# Altium project YunKeyboard.PrjPcb
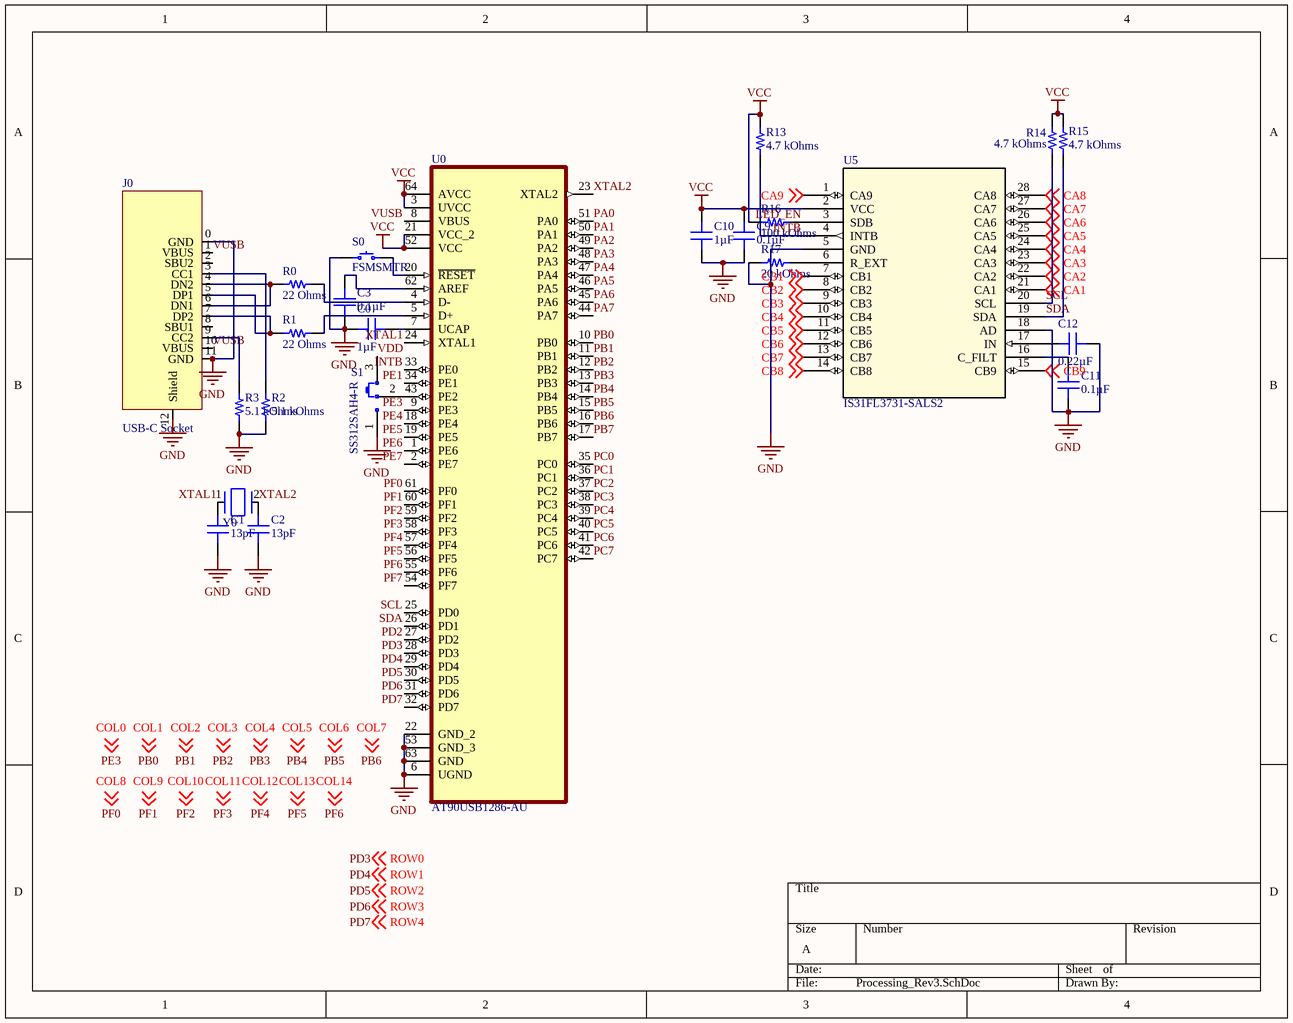
[diagram p0: Processing_Rev3.SchDoc]
3 sheets, 176 parts. Net scope: global (net labels, ports and power ports of the same name join across sheets).
Board file: YunKeyboard.PcbDoc
Sheets:
  Processing_Rev3.SchDoc
  BatUSBSwitchRev2.SchDoc
  KeyMatrixRev2.SchDoc

## Sheet Processing_Rev3.SchDoc
size A

### Parts
C0  1µF  [CAP 0805_2012]
C1  13pF  [CAP 0805_2012]
C2  13pF  [CAP 0805_2012]
C3  0.1µF  [CAP 0805_2012]
C9  0.1µF  [CAP 0805_2012]
C10  1µF  [CAP 0805_2012]
C11  0.1µF  [CAP 0805_2012]
C12  0.22µF  [CAP 0805_2012]
J0  USB-C Socket  [TYPE-C-31-M-12]
R0  22 Ohms  [RES 0805_2012]
R1  22 Ohms  [RES 0805_2012]
R2  5.1 kOhms  [RES 0805_2012]
R3  5.1 kOhms  [RES 0805_2012]
R13  4.7 kOhms  [RES 0805_2012]
R14  4.7 kOhms  [RES 0805_2012]
R15  4.7 kOhms  [RES 0805_2012]
R16  100 kOhms  [RES 0805_2012]
R17  20 kOhms  [RES 0805_2012]
S0  FSMSMTR  [TE FSMSMTR]
S1  SS312SAH4-R  [NKK SS312SAH4]
U0  AT90USB1286-AU  [QFP80P1600X1600X120-64N]
U5  IS31FL3731-SALS2  [SSOP-28_ISI]
Y0  9B-16.000MEEJ-B  [9B-16.000MEEJ-B]  (value not drawn)

### Nets
GND: C0.1 C1.1 C2.1 C3.1 C9.2 C10.2 C11.1 C12.1 J0.0(GND) J0.11(GND) J0.12(Shield) R2.1 R3.1 R17.2 S0.1 S1.1 U0.6(UGND) U0.22(GND_2) U0.53(GND_3) U0.63(GND) U5.5(GND) U5.18(AD)
VCC: C9.1 C10.1 R13.2 R14.2 R15.2 R16.1 U0.3(UVCC) U0.21(VCC_2) U0.52(VCC) U0.64(AVCC) U5.2(VCC)
CA1: U5.21(CA1) ; off-sheet CA1
CA2: U5.22(CA2) ; off-sheet CA2
CA3: U5.23(CA3) ; off-sheet CA3
CA4: U5.24(CA4) ; off-sheet CA4
CA5: U5.25(CA5) ; off-sheet CA5
CA6: U5.12(CB6) U5.26(CA6) ; off-sheet CA6, off-sheet CB6  [also labelled CB6]
CA7: U5.13(CB7) U5.27(CA7) ; off-sheet CA7, off-sheet CB7  [also labelled CB7]
CA8: U5.14(CB8) U5.28(CA8) ; off-sheet CA8, off-sheet CB8  [also labelled CB8]
CA9: U5.1(CA9) ; off-sheet CA9
CB1: U5.7(CB1) ; off-sheet CB1
CB2: U5.8(CB2) ; off-sheet CB2
CB3: U5.9(CB3) ; off-sheet CB3
CB4: U5.10(CB4) ; off-sheet CB4
CB5: U5.11(CB5) ; off-sheet CB5
CB9: U5.15(CB9) ; off-sheet CB9
INTB: R13.1 U0.33(PE0) U5.4(INTB)
LED_EN: R16.2 U5.3(SDB)
PA0: U0.51(PA0)
PA1: U0.50(PA1)
PA2: U0.49(PA2)
PA3: U0.48(PA3)
PA4: U0.47(PA4)
PA5: U0.46(PA5)
PA6: U0.45(PA6)
PA7: U0.44(PA7)
PB0: U0.10(PB0) ; off-sheet COL1  [also labelled COL1]
PB1: U0.11(PB1) ; off-sheet COL2  [also labelled COL2]
PB2: U0.12(PB2) ; off-sheet COL3  [also labelled COL3]
PB3: U0.13(PB3) ; off-sheet COL4  [also labelled COL4]
PB4: U0.14(PB4) ; off-sheet COL5  [also labelled COL5]
PB5: U0.15(PB5) ; off-sheet COL6  [also labelled COL6]
PB6: U0.16(PB6) ; off-sheet COL7  [also labelled COL7]
PB7: U0.17(PB7)
PC0: U0.35(PC0)
PC1: U0.36(PC1)
PC2: U0.37(PC2)
PC3: U0.38(PC3)
PC4: U0.39(PC4)
PC5: U0.40(PC5)
PC6: U0.41(PC6)
PC7: U0.42(PC7)
PD2: U0.27(PD2)
PD3: U0.28(PD3) ; off-sheet ROW0  [also labelled ROW0]
PD4: U0.29(PD4) ; off-sheet ROW1  [also labelled ROW1]
PD5: U0.30(PD5) ; off-sheet ROW2  [also labelled ROW2]
PD6: U0.31(PD6) ; off-sheet ROW3  [also labelled ROW3]
PD7: U0.32(PD7) ; off-sheet ROW4  [also labelled ROW4]
PE1: U0.34(PE1)
PE3: U0.9(PE3) ; off-sheet COL0  [also labelled COL0]
PE4: U0.18(PE4)
PE5: U0.19(PE5)
PE6: U0.1(PE6)
PE7: U0.2(PE7)
PF0: U0.61(PF0) ; off-sheet COL8  [also labelled COL8]
PF1: U0.60(PF1) ; off-sheet COL9  [also labelled COL9]
PF2: U0.59(PF2) ; off-sheet COL10  [also labelled COL10]
PF3: U0.58(PF3) ; off-sheet COL11  [also labelled COL11]
PF4: U0.57(PF4) ; off-sheet COL12  [also labelled COL12]
PF5: U0.56(PF5) ; off-sheet COL13  [also labelled COL13]
PF6: U0.55(PF6) ; off-sheet COL14  [also labelled COL14]
PF7: U0.54(PF7)
SCL: R14.1 U0.25(PD0) U5.20(SCL)
SDA: R15.1 U0.26(PD1) U5.19(SDA)
VDD: S1.3
VUSB: J0.1(VBUS) J0.10(VBUS) U0.8(VBUS)
XTAL1: C1.2 U0.24(XTAL1) Y0.1
XTAL2: C2.2 U0.23(XTAL2) Y0.2
NetC0_2: C0.2 U0.7(UCAP)
NetC3_2: C3.2 U0.62(AREF)
NetC11_2: C11.2 U5.16(C_FILT)
NetC12_2: C12.2 U5.17(IN)
NetJ0_3: J0.3(CC1) R2.2
NetJ0_4: J0.4(DN2) J0.6(DN1) R0.1
NetJ0_5: J0.5(DP1) J0.7(DP2) R1.1
NetJ0_9: J0.9(CC2) R3.2
NetR0_2: R0.2 U0.4(D-)
NetR1_2: R1.2 U0.5(D+)
NetR17_1: R17.1 U5.6(R_EXT)
NetS0_2: S0.2 U0.20(~{RESET})
NetS1_2: S1.2(COM) U0.43(PE2)

Not connected (* = marked no-connect by the designer): J0 2(SBU2) 8(SBU1)

### Library data of the parts
C0 C10 = GRM219R7YA105KA12D: CAP CER 1UF 35V X7R 0805; Manufacturer: Murata Electronics; Tolerance: ±10%; Part Number: GRM219R7YA105KA12D; Value: 1µF; Applications: General Purpose; Capacitance: 1µF; ComponentLink1Description: Datasheet; ComponentLink1URL: https://search.murata.co.jp/Ceramy/image/img/A01X/G101/ENG/GRM219R7YA105KA12-01.pdf; ComponentLink2Description: DigiKey Link; ComponentLink2URL: http://digikey.com/product-detail/en/murata-electronics/GRM219R7YA105KA12D/490-10494-1-ND/5026417; Device Package: 0805 (2012 Metric); LastUpdated: 1/21/2020 12:02:41 AM; Lifecycle Status: Active; Minimum Order: 1; Mounting Type: Surface Mount, MLCC; Operating Temperature: -55°C ~ 125°C; Package / Case: 0805 (2012 Metric); Packaging: TapeAndReel; PartId: 16877; Part Status: Active; Price: 0.05; Series: GRM; Size / Dimension: 0.079" L x 0.049" W (2.00mm x 1.25mm); Supplier 1: DigiKey; Supplier Part Number 1: 490-10494-1-ND; Temperature Coefficient: X7R; Thickness (Max): 0.037" (0.95mm); Voltage - Rated: 35V
C1 C2 = CBR08C130JAGAC: CAP CER 13PF 250V C0G/NP0 0805; Manufacturer: KEMET; Temperature Coefficient: C0G, NP0; Tolerance: ±5%; Part Number: CBR08C130JAGAC; Value: 13pF; Applications: RF, Microwave, High Frequency; Capacitance: 13pF; ComponentLink1Description: Datasheet; ComponentLink1URL: https://api.kemet.com/component-edge/download/datasheet/CBR08C130JAGAC.pdf; ComponentLink2Description: DigiKey Link; ComponentLink2URL: http://digikey.com/product-detail/en/kemet/CBR08C130JAGAC/399-8694-1-ND/3480285; Device Package: 0805 (2012 Metric); Features: High Q, Low Loss, Ultra Low ESR; LastUpdated: 1/21/2020 12:03:06 AM; Lifecycle Status: Active; Minimum Order: 1; Mounting Type: Surface Mount, MLCC; Operating Temperature: -55°C ~ 125°C; Package / Case: 0805 (2012 Metric); Packaging: TapeAndReel; PartId: 2446; Part Status: Active; Price: 0.50; Series: CBR-SMD RF C0G; Size / Dimension: 0.079" L x 0.049" W (2.00mm x 1.25mm); Supplier 1: DigiKey; Supplier Part Number 1: 399-8694-1-ND; Thickness (Max): 0.035" (0.88mm); Voltage - Rated: 250V
C3 C9 C11 = GRM21B7U1A104JA01L: CAP CER 0.1UF 10V U2J 0805; Manufacturer: Murata Electronics; Tolerance: ±5%; Part Number: GRM21B7U1A104JA01L; Value: 0.1µF; Applications: General Purpose; Capacitance: 0.1µF; ComponentLink1Description: Datasheet; ComponentLink1URL: https://search.murata.co.jp/Ceramy/image/img/A01X/G101/ENG/GRM21B7U1A104JA01-01.pdf; ComponentLink2Description: DigiKey Link; ComponentLink2URL: http://digikey.com/product-detail/en/murata-electronics/GRM21B7U1A104JA01L/490-11592-1-ND/5333432; Device Package: 0805 (2012 Metric); LastUpdated: 1/21/2020 12:02:41 AM; Lifecycle Status: Active; Minimum Order: 1; Mounting Type: Surface Mount, MLCC; Operating Temperature: -55°C ~ 125°C; Package / Case: 0805 (2012 Metric); Packaging: TapeAndReel; PartId: 16804; Part Status: Active; Price: 0.09; Series: GRM; Size / Dimension: 0.079" L x 0.049" W (2.00mm x 1.25mm); Supplier 1: DigiKey; Supplier Part Number 1: 490-11592-1-ND; Temperature Coefficient: U2J; Thickness (Max): 0.053" (1.35mm); Voltage - Rated: 10V
C12 = GCM21BR71H224KA37L: CAP CER 0.22UF 50V X7R 0805; Manufacturer: Murata Electronics; Tolerance: ±10%; Part Number: GCM21BR71H224KA37L; Value: 0.22µF; Applications: Automotive; Capacitance: 0.22µF; ComponentLink1Description: Datasheet; ComponentLink1URL: https://www.murata.com/~/media/webrenewal/support/library/catalog/products/capacitor/mlcc/c03e.ashx?la=en-us; ComponentLink2Description: DigiKey Link; ComponentLink2URL: http://digikey.com/product-detail/en/murata-electronics/GCM21BR71H224KA37L/490-4970-1-ND/1765289; Device Package: 0805 (2012 Metric); LastUpdated: 1/21/2020 12:03:05 AM; Lifecycle Status: Active; Minimum Order: 1; Mounting Type: Surface Mount, MLCC; Operating Temperature: -55°C ~ 125°C; Package / Case: 0805 (2012 Metric); Packaging: TapeAndReel; PartId: 2725; Part Status: Active; Price: 0.08; Ratings: AEC-Q200; Series: GCM; Size / Dimension: 0.079" L x 0.049" W (2.00mm x 1.25mm); Supplier 1: DigiKey; Supplier Part Number 1: 490-4970-1-ND; Temperature Coefficient: X7R; Thickness (Max): 0.055" (1.40mm); Voltage - Rated: 50V
J0 = TYPE-C-31-M-12
R0 R1 = ERA-6AHD220V: RES 22 OHM 0.5% 1/8W 0805; Manufacturer: Panasonic Electronic Components; Power (Watts): 0.125W, 1/8W; Temperature Coefficient: ±50ppm/°C; Part Number: ERA-6AHD220V; Value: 22 Ohms; ComponentLink1Description: Datasheet; ComponentLink1URL: https://industrial.panasonic.com/cdbs/www-data/pdf/RDM0000/AOA0000C307.pdf; ComponentLink2Description: DigiKey Link; ComponentLink2URL: http://digikey.com/product-detail/en/panasonic-electronic-components/ERA-6AHD220V/P123893CT-ND/9467822; Composition: Thin Film; Device Package: 0805 (2012 Metric); Features: Automotive AEC-Q200; Height - Seated (Max): 0.024" (0.60mm); LastUpdated: 1/21/2020 1:42:40 AM; Lifecycle Status: Active; Minimum Order: 1; Number of Terminations: 2; Operating Temperature: -55°C ~ 155°C; Package / Case: 0805 (2012 Metric); Packaging: TapeAndReel; PartId: 44407; Part Status: Active; Price: 0.01; Ratings: AEC-Q200; Resistance: 22 Ohms; Series: ERA-6A; Size / Dimension: 0.079" L x 0.049" W (2.00mm x 1.25mm); Supplier 1: DigiKey; Supplier Part Number 1: P123893CT-ND; Supplier Device Package: 0805; Tolerance: ±0.5%
R2 R3 = ERJ-6ENF5101V: RES SMD 5.1K OHM 1% 1/8W 0805; Manufacturer: Panasonic Electronic Components; Power (Watts): 0.125W, 1/8W; Temperature Coefficient: ±100ppm/°C; Part Number: ERJ-6ENF5101V; Value: 5.1 kOhms; ComponentLink1Description: Datasheet; ComponentLink1URL: https://industrial.panasonic.com/cdbs/www-data/pdf/RDA0000/AOA0000C304.pdf; ComponentLink2Description: DigiKey Link; ComponentLink2URL: http://digikey.com/product-detail/en/panasonic-electronic-components/ERJ-6ENF5101V/P5.10KCCT-ND/1746877; Composition: Thick Film; Device Package: 0805 (2012 Metric); Features: Automotive AEC-Q200; Height - Seated (Max): 0.028" (0.70mm); LastUpdated: 1/21/2020 1:48:57 AM; Lifecycle Status: Active; Minimum Order: 1; Number of Terminations: 2; Operating Temperature: -55°C ~ 155°C; Package / Case: 0805 (2012 Metric); Packaging: TapeAndReel; PartId: 30273; Part Status: Active; Price: 0.01; Ratings: AEC-Q200; Resistance: 5.1 kOhms; Series: ERJ; Size / Dimension: 0.079" L x 0.049" W (2.00mm x 1.25mm); Supplier 1: DigiKey; Supplier Part Number 1: P5.10KCCT-ND; Supplier Device Package: 0805; Tolerance: ±1%
R13-R15 = ERJ-6ENF4701V: RES SMD 4.7K OHM 1% 1/8W 0805; Manufacturer: Panasonic Electronic Components; Power (Watts): 0.125W, 1/8W; Temperature Coefficient: ±100ppm/°C; Part Number: ERJ-6ENF4701V; Value: 4.7 kOhms; ComponentLink1Description: Datasheet; ComponentLink1URL: https://industrial.panasonic.com/cdbs/www-data/pdf/RDA0000/AOA0000C304.pdf; ComponentLink2Description: DigiKey Link; ComponentLink2URL: http://digikey.com/product-detail/en/panasonic-electronic-components/ERJ-6ENF4701V/P4.70KCCT-ND/1746872; Composition: Thick Film; Device Package: 0805 (2012 Metric); Features: Automotive AEC-Q200; Height - Seated (Max): 0.028" (0.70mm); LastUpdated: 1/21/2020 1:48:04 AM; Lifecycle Status: Active; Minimum Order: 1; Number of Terminations: 2; Operating Temperature: -55°C ~ 155°C; Package / Case: 0805 (2012 Metric); Packaging: TapeAndReel; PartId: 32254; Part Status: Active; Price: 0.01; Ratings: AEC-Q200; Resistance: 4.7 kOhms; Series: ERJ; Size / Dimension: 0.079" L x 0.049" W (2.00mm x 1.25mm); Supplier 1: DigiKey; Supplier Part Number 1: P4.70KCCT-ND; Supplier Device Package: 0805; Tolerance: ±1%
R16 = ERJ-6ENF1003V: RES SMD 100K OHM 1% 1/8W 0805; Manufacturer: Panasonic Electronic Components; Power (Watts): 0.125W, 1/8W; Temperature Coefficient: ±100ppm/°C; Part Number: ERJ-6ENF1003V; Value: 100 kOhms; ComponentLink1Description: Datasheet; ComponentLink1URL: https://industrial.panasonic.com/cdbs/www-data/pdf/RDA0000/AOA0000C304.pdf; ComponentLink2Description: DigiKey Link; ComponentLink2URL: http://digikey.com/product-detail/en/panasonic-electronic-components/ERJ-6ENF1003V/P100KCCT-ND/119551; Composition: Thick Film; Device Package: 0805 (2012 Metric); Features: Automotive AEC-Q200; Height - Seated (Max): 0.028" (0.70mm); LastUpdated: 1/21/2020 1:48:04 AM; Lifecycle Status: Active; Minimum Order: 1; Number of Terminations: 2; Operating Temperature: -55°C ~ 155°C; Package / Case: 0805 (2012 Metric); Packaging: TapeAndReel; PartId: 32252; Part Status: Active; Price: 0.01; Ratings: AEC-Q200; Resistance: 100 kOhms; Series: ERJ; Size / Dimension: 0.079" L x 0.049" W (2.00mm x 1.25mm); Supplier 1: DigiKey; Supplier Part Number 1: P100KCCT-ND; Supplier Device Package: 0805; Tolerance: ±1%
R17 = ERA-6AEB203V: RES 20K OHM 0.1% 1/8W 0805; Manufacturer: Panasonic Electronic Components; Power (Watts): 0.125W, 1/8W; Temperature Coefficient: ±25ppm/°C; Part Number: ERA-6AEB203V; Value: 20 kOhms; ComponentLink1Description: Datasheet; ComponentLink1URL: https://industrial.panasonic.com/cdbs/www-data/pdf/RDM0000/AOA0000C307.pdf; ComponentLink2Description: DigiKey Link; ComponentLink2URL: http://digikey.com/product-detail/en/panasonic-electronic-components/ERA-6AEB203V/P20KDACT-ND/1465978; Composition: Thin Film; Device Package: 0805 (2012 Metric); Features: Automotive AEC-Q200; Height - Seated (Max): 0.024" (0.60mm); LastUpdated: 1/21/2020 1:49:56 AM; Lifecycle Status: Active; Minimum Order: 1; Number of Terminations: 2; Operating Temperature: -55°C ~ 155°C; Package / Case: 0805 (2012 Metric); Packaging: TapeAndReel; PartId: 28073; Part Status: Active; Price: 0.04; Ratings: AEC-Q200; Resistance: 20 kOhms; Series: ERA-6A; Size / Dimension: 0.079" L x 0.049" W (2.00mm x 1.25mm); Supplier 1: DigiKey; Supplier Part Number 1: P20KDACT-ND; Supplier Device Package: 0805; Tolerance: ±0.1%
S0 = FSMSMTR: SWITCH TACTILE SPST-NO 0.05A 24V; Manufacturer: TE Connectivity ALCOSWITCH Switches; Actuator Height off PCB, Vertical: 4.57mm; Actuator Orientation: Top Actuated; Actuator Type: Standard; Contact Rating @ Voltage: 0.05A @ 24VDC; Illumination: Non-Illuminated; Operating Force: 180gf; Outline: 6.00mm x 3.50mm; Switch Function: Off-Mom; Part Number: FSMSMTR; Circuit: SPST-NO; ComponentLink1Description: Datasheet; ComponentLink1URL: https://www.te.com/commerce/DocumentDelivery/DDEController?Action=srchrtrv&DocNm=1437566-3&DocType=Customer+Drawing&DocLang=English; ComponentLink2Description: DigiKey Link; ComponentLink2URL: http://digikey.com/product-detail/en/te-connectivity-alcoswitch-switches/FSMSMTR/450-1758-1-ND/2271637; LastUpdated: 1/25/2020 8:03:55 PM; Lifecycle Status: Active; Minimum Order: 1; Mounting Type: Surface Mount; Operating Temperature: -35°C ~ 85°C; Packaging: TapeAndReel; Part Status: Active; Price: 0.19; Series: FSMSM; Supplier 1: DigiKey; Supplier Part Number 1: 450-1758-1-ND; Termination Style: Gull Wing
S1 = SS312SAH4-R: SWITCH SLIDE SPDT 0.4VA 28V; Manufacturer: NKK Switches; Actuator Length: 2.00mm; Actuator Type: Standard; Contact Timing: Shorting (MBB); Current Rating (Amps): 0.4VA (AC/DC); Switch Function: On-On; Part Number: SS312SAH4-R; Circuit: SPDT; ComponentLink1Description: Datasheet; ComponentLink1URL: http://www.nkkswitches.com/pdf/SS3surfaceMount-1.pdf; ComponentLink2Description: DigiKey Link; ComponentLink2URL: http://digikey.com/product-detail/en/nkk-switches/SS312SAH4-R/360-2924-1-ND/1051215; Contact Finish: Gold; Contact Material: Phosphor Bronze; LastUpdated: 1/4/2020 7:10:14 PM; Lifecycle Status: Active; Minimum Order: 1; Mounting Type: Surface Mount, Right Angle; Operating Temperature: -25°C ~ 85°C; Packaging: TapeAndReel; PartId: 1; Part Status: Active; Price: 1.95; Series: SS3; Supplier 1: DigiKey; Supplier Part Number 1: 360-2924-1-ND; Termination Style: Gull Wing; Voltage Rating - AC: 28V; Voltage Rating - DC: 28V
U0 = AT90USB1286-AU: AVR AVRÂ® 90USB Microcontroller IC 8-Bit 16MHz 128KB _128K x 8_ FLASH 64-TQFP _14x14_; MF: Microchip; Value: *; Package: TQFP-64 Microchip; Price: None; MP: AT90USB1286-AU; Availability: Unavailable; SnapEDA_Link: https://www.snapeda.com/parts/AT90USB1286-AU/Microchip/view-part/598497/?ref=snap
U5 = IS31FL3731-SALS2: No Description Available; Vendor: ISSI; Built_By: EMA_Cory; SourceLibrary: ISSI_2020-02-04; Datasheet: http://www.issi.com/WW/pdf/31FL3731.pdf; Manufacturer_Part_Number: IS31FL3731-SALS2; Copyright: Copyright (C) 2018 Accelerated Designs. All rights reserved; RefDes: RefDes; Type: DEV
Y0 = 9B-16.000MEEJ-B: CRYS 16MHz ±10ppm Crystal 18pF 30 Ohm -20°C ~ 70°C Through Hole HC49/US; Part Number: ABL-16.000MHZ-B2; Manufacturer: Abracon; Frequency Tolerance: ±20ppm; Frequency Stability: ±50ppm; ESR: 40 Ohm; Operating Mode: Fundamental; helpURL: https://upverter.com/upn/revision/7ebf07e1da2eb130/; ComponentLink2Description: Datasheet; Temperature: 0ºC to +70ºC; Package: HC/49US; Supplier 2: Mouser; Price: 0.175999999027; Supplier 1: Digi-Key; ComponentLink1URL: https://upverter.com/upn/revision/7ebf07e1da2eb130/; Supplier Part Number 2: 815-ABL-16-B2; Supplier Part Number 1: 535-9041-ND; ComponentLink1Description: Upverter; ComponentLink2URL: http://www.abracon.com/Resonators/ABL.pdf; RoHS: TRUE; Mouser Part Number: 815-ABL-16-B2; Temperature Range High: +70ºC; Digikey Description: CRYS 16MHz ±20ppm Crystal 18pF 40 Ohm -20°C ~ 70°C Through Hole HC49/US; Digikey Part Number: 535-9041-ND; Lead Free: yes; Temperature Range Low: 0ºC; Load Capacitance: 18pF; Frequency: 16MHz

## Sheet BatUSBSwitchRev2.SchDoc
size A
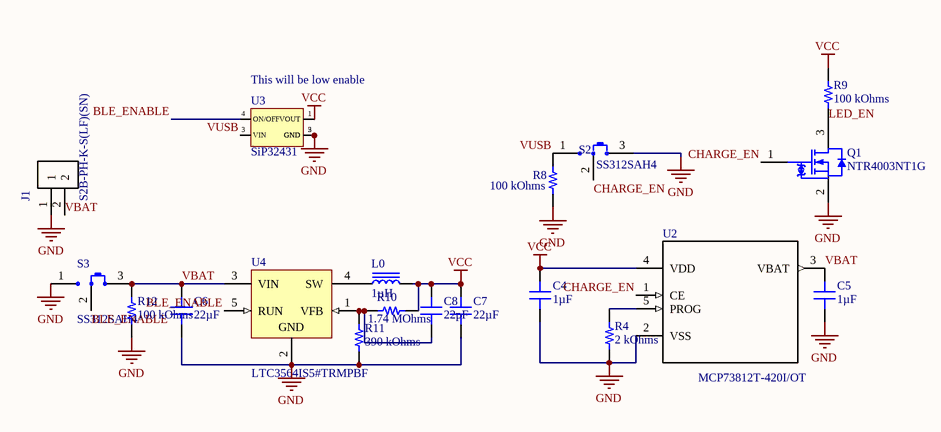
[diagram p1: BatUSBSwitchRev2.SchDoc]

### Parts
C4  1µF  [CAP 0805_2012]
C5  1µF  [CAP 0805_2012]
C6  22µF  [CAP 0805_2012]
C7  22µF  [CAP 0805_2012]
C8  22pF  [CAP 0805_2012]
J1  S2B-PH-K-S(LF)(SN)  [JST_S2B-PH-K-S(LF)(SN)]
L0  1µH  [IND 0806_2016]
Q1  NTR4003NT1G  [ONSC-SOT-23-3-318-08_V]
R4  2 kOhms  [RES 0805_2012]
R8  100 kOhms  [RES 0805_2012]
R9  100 kOhms  [RES 0805_2012]
R10  1.74 MOhms  [RES 0805_2012]
R11  390 kOhms  [RES 0805_2012]
R12  100 kOhms  [RES 0805_2012]
S2  SS312SAH4  [NKK SS312SAH4]
S3  SS312SAH4  [NKK SS312SAH4]
U2  MCP73812T-420I/OT  [*SOT95P270X145-5N]
U3  SiP32431  [SiP32431_TDFN4]
U4  LTC3564IS5#TRMPBF  [LT-S5-5-TSOT-23_N]

### Nets
GND: C4.1 C5.1 C6.1 C7.1 J1.1 Q1.2(S) R4.1 R8.1 R11.1 R12.1 S2.3 S3.1 U2.2(VSS) U3.2(GND) U3.5(GND) U4.2(GND)
VCC: C4.2 C7.2 C8.2 L0.2 R9.2 R10.2 U2.4(VDD) U3.1(VOUT)
BLE_ENABLE: S3.2(COM) U3.4(ON/OFF) U4.5(RUN)
CHARGE_EN: Q1.1(G) S2.2(COM) U2.1(CE)
LED_EN: Q1.3(D) R9.1
VBAT: C5.2 C6.2 J1.2 R12.2 S3.3 U2.3(VBAT) U4.3(VIN)
VUSB: R8.2 S2.1 U3.3(VIN)
NetC8_1: C8.1 R10.1 R11.2 U4.1(VFB)
NetL0_1: L0.1 U4.4(SW)
NetR4_2: R4.2 U2.5(PROG)

### Notes on the sheet
- (near U3) This will be low enable

### Library data of the parts
C4 C5 = GRM219R7YA105KA12D: as C0 on sheet Processing_Rev3; Part Number: GRM219R7YA105KA12D; Value: 1µF; Applications: General Purpose; Capacitance: 1µF; ComponentLink1Description: Datasheet; ComponentLink1URL: https://search.murata.co.jp/Ceramy/image/img/A01X/G101/ENG/GRM219R7YA105KA12-01.pdf; ComponentLink2Description: DigiKey Link; ComponentLink2URL: http://digikey.com/product-detail/en/murata-electronics/GRM219R7YA105KA12D/490-10494-1-ND/5026417; Device Package: 0805 (2012 Metric); LastUpdated: 1/21/2020 12:02:41 AM; Lifecycle Status: Active; Minimum Order: 1; Mounting Type: Surface Mount, MLCC; Operating Temperature: -55°C ~ 125°C; Package / Case: 0805 (2012 Metric); Packaging: TapeAndReel; PartId: 16877; Part Status: Active; Price: 0.05; Series: GRM; Size / Dimension: 0.079" L x 0.049" W (2.00mm x 1.25mm); Supplier 1: DigiKey; Supplier Part Number 1: 490-10494-1-ND; Temperature Coefficient: X7R; Thickness (Max): 0.037" (0.95mm); Voltage - Rated: 35V
C6 C7 = GRM21BR60J226ME39K: CAP CER 22UF 6.3V X5R 0805; Manufacturer: Murata Electronics; Tolerance: ±20%; Part Number: GRM21BR60J226ME39K; Value: 22µF; Applications: General Purpose; Capacitance: 22µF; ComponentLink1Description: Datasheet; ComponentLink1URL: https://search.murata.co.jp/Ceramy/image/img/A01X/G101/ENG/GRM21BR60J226ME39-01.pdf; ComponentLink2Description: DigiKey Link; ComponentLink2URL: http://digikey.com/product-detail/en/murata-electronics/GRM21BR60J226ME39K/490-6471-1-ND/3845668; Device Package: 0805 (2012 Metric); LastUpdated: 1/21/2020 12:02:52 AM; Lifecycle Status: Active; Minimum Order: 1; Mounting Type: Surface Mount, MLCC; Operating Temperature: -55°C ~ 85°C; Package / Case: 0805 (2012 Metric); Packaging: TapeAndReel; PartId: 11540; Part Status: Active; Price: 0.09; Series: GRM; Size / Dimension: 0.079" L x 0.049" W (2.00mm x 1.25mm); Supplier 1: DigiKey; Supplier Part Number 1: 490-6471-1-ND; Temperature Coefficient: X5R; Thickness (Max): 0.053" (1.35mm); Voltage - Rated: 6.3V
C8 = GRM21A5C2E220JW01D: CAP CER 22PF 250V C0G/NP0 0805; Manufacturer: Murata Electronics; Temperature Coefficient: C0G, NP0; Tolerance: ±5%; Part Number: GRM21A5C2E220JW01D; Value: 22pF; Applications: General Purpose; Capacitance: 22pF; ComponentLink1Description: Datasheet; ComponentLink1URL: https://search.murata.co.jp/Ceramy/image/img/A01X/G101/ENG/GRM21A5C2E220JW01-01.pdf; ComponentLink2Description: DigiKey Link; ComponentLink2URL: http://digikey.com/product-detail/en/murata-electronics/GRM21A5C2E220JW01D/490-5534-1-ND/2334930; Device Package: 0805 (2012 Metric); LastUpdated: 1/21/2020 12:03:03 AM; Lifecycle Status: Active; Minimum Order: 1; Mounting Type: Surface Mount, MLCC; Operating Temperature: -55°C ~ 125°C; Package / Case: 0805 (2012 Metric); Packaging: TapeAndReel; PartId: 4520; Part Status: Active; Price: 0.07; Series: GRM; Size / Dimension: 0.079" L x 0.049" W (2.00mm x 1.25mm); Supplier 1: DigiKey; Supplier Part Number 1: 490-5534-1-ND; Thickness (Max): 0.039" (1.00mm); Voltage - Rated: 250V
J1 = S2B-PH-K-S(LF)(SN): PH Series 2 Position 2.0 mm Through Hole Side Entry Shrouded Header; MP: S2B-PH-K-S_LF__SN_; MF: JST Sales; SnapEDA_Link: https://www.snapeda.com/parts/S2B-PH-K-S%28LF%29%28SN%29/JST%20Sales%20America%20Inc./view-part/?ref=snap; Digi-Key_Part_Number: 455-1719-ND; Package: FakePackage u; Digi-Key_Purchase_URL: https://www.digikey.com/product-detail/en/jst-sales-america-inc/S2B-PH-K-S_LF__SN_/455-1719-ND/926626?utm_source=snapeda&utm_medium=aggregator&utm_campaign=symbol; Value: *
L0 = DFE201612E-1R0M=P2: FIXED IND 1UH 2.9A 48 MOHM SMD; Manufacturer: Murata Electronics; Current - Saturation: 4A; DC Resistance (DCR): 48mOhm Max; Inductance Frequency - Test: 1MHz; Material - Core: Metal; Shielding: Shielded; Tolerance: ±20%; Type: Wirewound; Part Number: DFE201612E-1R0M=P2; ComponentLink1Description: Datasheet; ComponentLink1URL: https://search.murata.co.jp/Ceramy/image/img/P02/J(E)TE243A-0006_DFE201612E_reference.pdf; ComponentLink2Description: DigiKey Link; ComponentLink2URL: http://digikey.com/product-detail/en/murata-electronics/DFE201612E-1R0M=P2/490-16593-1-ND/7595517; Current Rating (Amps): 2.9A; Device Package: 0806 (2016 Metric); Height - Seated (Max): 0.047" (1.20mm); Inductance: 1µH; LastUpdated: 1/21/2020 3:56:31 AM; Lifecycle Status: Active; Minimum Order: 1; Mounting Type: Surface Mount; Operating Temperature: -40°C ~ 125°C; Package / Case: 0806 (2016 Metric); Packaging: TapeAndReel; PartId: 2779; Part Status: Active; Price: 0.17; Series: DFE201612E; Size / Dimension: 0.079" L x 0.063" W (2.00mm x 1.60mm); Supplier 1: DigiKey; Supplier Part Number 1: 490-16593-1-ND; Supplier Device Package: 0806 (2016 Metric); Value: 1µH
Q1 = NTR4003NT1G: Small Signal MOSFET, 30 V, 0.56 A, Single N-Channe, 3-Pin SOT-23, Pb-Free, Tape and Reel; Manufacturer: On Semiconductor; VGS(th) Max (V): 1.4; Crss Typ (pF): 8.1; Channel Polarity: N Channel; Coss Typ (pF): 19.7; ID Max (A): 0.56; Ciss Typ (pF): 21; V(BR)DSS Min (V): 30; VGS Max (V): 20; PartNumber: NTR4003NT1G; ComponentLink1Description: Manufacturer URL; ComponentLink2Description: Datasheet; DatasheetVersion: Rev. 3; ComponentLink3URL: http://www.onsemi.cn/pub_link/Collateral/318-08.PDF; ComponentLink3Description: Package Specification; ComponentLink1URL: http://www.onsemi.com/; Packing: Tape and Reel; Package Type: SOT-23-3; Configuration: Single; ComponentLink2URL: http://www.onsemi.cn/pub_link/Collateral/NTR4003N-D.PDF; PackageVersion: Rev. AP, 11/2009; RoHS: Pb-Free; Mounting Technology: Surface Mount; PackageReference: SOT-23-3-318-08; PackageDescription: 3-Pin Small Outline Transistor, Body 2.92 x 1.3 mm, Pitch 0.95 mm
R4 = ERA-6AEB202V: RES 2K OHM 0.1% 1/8W 0805; Manufacturer: Panasonic Electronic Components; Power (Watts): 0.125W, 1/8W; Temperature Coefficient: ±25ppm/°C; Part Number: ERA-6AEB202V; Value: 2 kOhms; ComponentLink1Description: Datasheet; ComponentLink1URL: https://industrial.panasonic.com/cdbs/www-data/pdf/RDM0000/AOA0000C307.pdf; ComponentLink2Description: DigiKey Link; ComponentLink2URL: http://digikey.com/product-detail/en/panasonic-electronic-components/ERA-6AEB202V/P2.0KDACT-ND/1465954; Composition: Thin Film; Device Package: 0805 (2012 Metric); Features: Automotive AEC-Q200; Height - Seated (Max): 0.024" (0.60mm); LastUpdated: 1/21/2020 1:49:56 AM; Lifecycle Status: Active; Minimum Order: 1; Number of Terminations: 2; Operating Temperature: -55°C ~ 155°C; Package / Case: 0805 (2012 Metric); Packaging: TapeAndReel; PartId: 28084; Part Status: Active; Price: 0.04; Ratings: AEC-Q200; Resistance: 2 kOhms; Series: ERA-6A; Size / Dimension: 0.079" L x 0.049" W (2.00mm x 1.25mm); Supplier 1: DigiKey; Supplier Part Number 1: P2.0KDACT-ND; Supplier Device Package: 0805; Tolerance: ±0.1%
R8 R9 R12 = ERJ-6ENF1003V: as R16 on sheet Processing_Rev3; Part Number: ERJ-6ENF1003V; Value: 100 kOhms; ComponentLink1Description: Datasheet; ComponentLink1URL: https://industrial.panasonic.com/cdbs/www-data/pdf/RDA0000/AOA0000C304.pdf; ComponentLink2Description: DigiKey Link; ComponentLink2URL: http://digikey.com/product-detail/en/panasonic-electronic-components/ERJ-6ENF1003V/P100KCCT-ND/119551; Composition: Thick Film; Device Package: 0805 (2012 Metric); Features: Automotive AEC-Q200; Height - Seated (Max): 0.028" (0.70mm); LastUpdated: 1/21/2020 1:48:04 AM; Lifecycle Status: Active; Minimum Order: 1; Number of Terminations: 2; Operating Temperature: -55°C ~ 155°C; Package / Case: 0805 (2012 Metric); Packaging: TapeAndReel; PartId: 32252; Part Status: Active; Price: 0.01; Ratings: AEC-Q200; Resistance: 100 kOhms; Series: ERJ; Size / Dimension: 0.079" L x 0.049" W (2.00mm x 1.25mm); Supplier 1: DigiKey; Supplier Part Number 1: P100KCCT-ND; Supplier Device Package: 0805; Tolerance: ±1%
R10 = ERJ-6ENF1744V: RES SMD 1.74M OHM 1% 1/8W 0805; Manufacturer: Panasonic Electronic Components; Power (Watts): 0.125W, 1/8W; Temperature Coefficient: ±100ppm/°C; Part Number: ERJ-6ENF1744V; Value: 1.74 MOhms; ComponentLink1Description: Datasheet; ComponentLink1URL: https://industrial.panasonic.com/cdbs/www-data/pdf/RDA0000/AOA0000C304.pdf; ComponentLink2Description: DigiKey Link; ComponentLink2URL: http://digikey.com/product-detail/en/panasonic-electronic-components/ERJ-6ENF1744V/P1.74BTCT-ND/4429146; Composition: Thick Film; Device Package: 0805 (2012 Metric); Features: Automotive AEC-Q200; Height - Seated (Max): 0.028" (0.70mm); LastUpdated: 1/21/2020 1:44:32 AM; Lifecycle Status: Active; Minimum Order: 1; Number of Terminations: 2; Operating Temperature: -55°C ~ 155°C; Package / Case: 0805 (2012 Metric); Packaging: TapeAndReel; PartId: 40274; Part Status: Active; Price: 0.01; Ratings: AEC-Q200; Resistance: 1.74 MOhms; Series: ERJ; Size / Dimension: 0.079" L x 0.049" W (2.00mm x 1.25mm); Supplier 1: DigiKey; Supplier Part Number 1: P1.74BTCT-ND; Supplier Device Package: 0805; Tolerance: ±1%
R11 = ERA-6AEB394V: RES 390K OHM 0.1% 1/8W 0805; Manufacturer: Panasonic Electronic Components; Power (Watts): 0.125W, 1/8W; Temperature Coefficient: ±25ppm/°C; Part Number: ERA-6AEB394V; Value: 390 kOhms; ComponentLink1Description: Datasheet; ComponentLink1URL: https://industrial.panasonic.com/cdbs/www-data/pdf/RDM0000/AOA0000C307.pdf; ComponentLink2Description: DigiKey Link; ComponentLink2URL: http://digikey.com/product-detail/en/panasonic-electronic-components/ERA-6AEB394V/P390KDACT-ND/1466009; Composition: Thin Film; Device Package: 0805 (2012 Metric); Features: Automotive AEC-Q200; Height - Seated (Max): 0.024" (0.60mm); LastUpdated: 1/21/2020 1:39:37 AM; Lifecycle Status: Active; Minimum Order: 1; Number of Terminations: 2; Operating Temperature: -55°C ~ 155°C; Package / Case: 0805 (2012 Metric); Packaging: TapeAndReel; PartId: 48815; Part Status: Active; Price: 0.04; Ratings: AEC-Q200; Resistance: 390 kOhms; Series: ERA-6A; Size / Dimension: 0.079" L x 0.049" W (2.00mm x 1.25mm); Supplier 1: DigiKey; Supplier Part Number 1: P390KDACT-ND; Supplier Device Package: 0805; Tolerance: ±0.1%
S2 S3 = SS312SAH4: SWITCH SLIDE SPDT 0.4VA 28V; Manufacturer: NKK Switches; Actuator Length: 2.00mm; Actuator Type: Standard; Contact Timing: Shorting (MBB); Current Rating (Amps): 0.4VA (AC/DC); Switch Function: On-On; Part Number: SS312SAH4; Circuit: SPDT; ComponentLink1Description: Datasheet; ComponentLink1URL: http://www.nkkswitches.com/pdf/SS3surfaceMount-1.pdf; ComponentLink2Description: DigiKey Link; ComponentLink2URL: http://digikey.com/product-detail/en/nkk-switches/SS312SAH4/360-3250-ND/1052031; Contact Finish: Gold; Contact Material: Phosphor Bronze; LastUpdated: 1/4/2020 7:15:23 PM; Lifecycle Status: Active; Minimum Order: 1; Mounting Type: Surface Mount, Right Angle; Operating Temperature: -25°C ~ 85°C; Packaging: Tray; PartId: 2; Part Status: Active; Price: 3.02; Series: SS3; Supplier 1: DigiKey; Supplier Part Number 1: 360-3250-ND; Termination Style: Gull Wing; Voltage Rating - AC: 28V; Voltage Rating - DC: 28V
U2 = MCP73812T-420I/OT: Sot23 Simple Low-Cost Integrated Li-Ion/Li-Poly Charge Mgnt Controller, 4.2v Vre; MF: Microchip; Price: None; SnapEDA_Link: https://www.snapeda.com/parts/MCP73812T-420I/OT/Microchip/view-part/?ref=snap; Availability: Unavailable; MP: MCP73812T-420I/OT; Package: SOT-23 Microchip; Value: *
U3 = SiP32431: Ultra low quiescent current load switch, low enable
U4 = LTC3564IS5#TRMPBF: 2.25 MHz, 1.25 A Synchronous Step-Down Regulator, 5-pin SOT23 (S5-5), -40 to 125 degC, Pb-Free, Mini Tape and Reel; Manufacturer: Linear Technology; Number of Outputs: 1; ComponentLink1Description: Manufacturer URL; ComponentLink2Description: Datasheet; ComponentLink3Description: Package Specification; Mounting Technology: Surface Mount; ComponentLink3URL: http://cds.linear.com/docs/en/packaging/SOT_5_05-08-1635.pdf; ComponentLink1URL: http://www.linear.com/; Code_JEDEC: MO-193; Packing: Mini Tape and Reel; PackageVersion: Jun-10; RoHS: TRUE; PartNumber: LTC3564IS5#TRMPBF; PackageReference: S5-5; PackageDescription: 5-Pin Plastic TSOT-23, Body 1.63 x 2.90 mm, Pitch 0.95 mm; ComponentLink2URL: http://cds.linear.com/docs/en/datasheet/3564f.pdf

## Sheet KeyMatrixRev2.SchDoc
size B
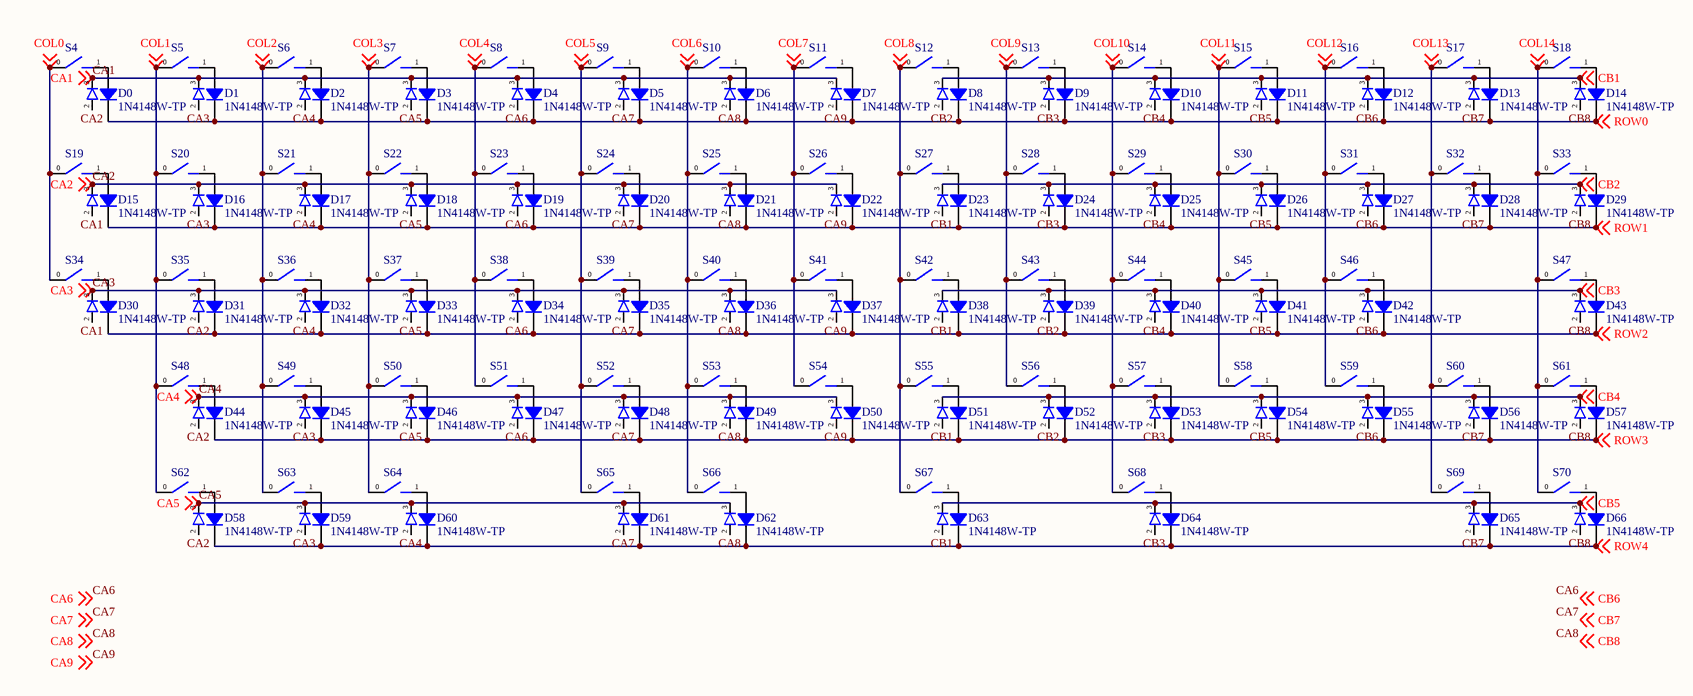
[diagram p2: KeyMatrixRev2.SchDoc]

### Parts
D0  1N4148W-TP  [SOD-123]
D1  1N4148W-TP  [SOD-123]
D2  1N4148W-TP  [SOD-123]
D3  1N4148W-TP  [SOD-123]
D4  1N4148W-TP  [SOD-123]
D5  1N4148W-TP  [SOD-123]
D6  1N4148W-TP  [SOD-123]
D7  1N4148W-TP  [SOD-123]
D8  1N4148W-TP  [SOD-123]
D9  1N4148W-TP  [SOD-123]
D10  1N4148W-TP  [SOD-123]
D11  1N4148W-TP  [SOD-123]
D12  1N4148W-TP  [SOD-123]
D13  1N4148W-TP  [SOD-123]
D14  1N4148W-TP  [SOD-123]
D15  1N4148W-TP  [SOD-123]
D16  1N4148W-TP  [SOD-123]
D17  1N4148W-TP  [SOD-123]
D18  1N4148W-TP  [SOD-123]
D19  1N4148W-TP  [SOD-123]
D20  1N4148W-TP  [SOD-123]
D21  1N4148W-TP  [SOD-123]
D22  1N4148W-TP  [SOD-123]
D23  1N4148W-TP  [SOD-123]
D24  1N4148W-TP  [SOD-123]
D25  1N4148W-TP  [SOD-123]
D26  1N4148W-TP  [SOD-123]
D27  1N4148W-TP  [SOD-123]
D28  1N4148W-TP  [SOD-123]
D29  1N4148W-TP  [SOD-123]
D30  1N4148W-TP  [SOD-123]
D31  1N4148W-TP  [SOD-123]
D32  1N4148W-TP  [SOD-123]
D33  1N4148W-TP  [SOD-123]
D34  1N4148W-TP  [SOD-123]
D35  1N4148W-TP  [SOD-123]
D36  1N4148W-TP  [SOD-123]
D37  1N4148W-TP  [SOD-123]
D38  1N4148W-TP  [SOD-123]
D39  1N4148W-TP  [SOD-123]
D40  1N4148W-TP  [SOD-123]
D41  1N4148W-TP  [SOD-123]
D42  1N4148W-TP  [SOD-123]
D43  1N4148W-TP  [SOD-123]
D44  1N4148W-TP  [SOD-123]
D45  1N4148W-TP  [SOD-123]
D46  1N4148W-TP  [SOD-123]
D47  1N4148W-TP  [SOD-123]
D48  1N4148W-TP  [SOD-123]
D49  1N4148W-TP  [SOD-123]
D50  1N4148W-TP  [SOD-123]
D51  1N4148W-TP  [SOD-123]
D52  1N4148W-TP  [SOD-123]
D53  1N4148W-TP  [SOD-123]
D54  1N4148W-TP  [SOD-123]
D55  1N4148W-TP  [SOD-123]
D56  1N4148W-TP  [SOD-123]
D57  1N4148W-TP  [SOD-123]
D58  1N4148W-TP  [SOD-123]
D59  1N4148W-TP  [SOD-123]
D60  1N4148W-TP  [SOD-123]
D61  1N4148W-TP  [SOD-123]
D62  1N4148W-TP  [SOD-123]
D63  1N4148W-TP  [SOD-123]
D64  1N4148W-TP  [SOD-123]
D65  1N4148W-TP  [SOD-123]
D66  1N4148W-TP  [SOD-123]
S4  Cherry  [CHERRY-MX-LED-1U]  (value not drawn)
S5  Cherry  [CHERRY-MX-LED-1U]  (value not drawn)
S6  Cherry  [CHERRY-MX-LED-1U]  (value not drawn)
S7  Cherry  [CHERRY-MX-LED-1U]  (value not drawn)
S8  Cherry  [CHERRY-MX-LED-1U]  (value not drawn)
S9  Cherry  [CHERRY-MX-LED-1U]  (value not drawn)
S10  Cherry  [CHERRY-MX-LED-1U]  (value not drawn)
S11  Cherry  [CHERRY-MX-LED-1U]  (value not drawn)
S12  Cherry  [CHERRY-MX-LED-1U]  (value not drawn)
S13  Cherry  [CHERRY-MX-LED-1U]  (value not drawn)
S14  Cherry  [CHERRY-MX-LED-1U]  (value not drawn)
S15  Cherry  [CHERRY-MX-LED-1U]  (value not drawn)
S16  Cherry  [CHERRY-MX-LED-1U]  (value not drawn)
S17  Cherry  [CHERRY-MX-LED-1U]  (value not drawn)
S18  Cherry  [CHERRY-MX-LED-2U]  (value not drawn)
S19  Cherry  [CHERRY-MX-LED-1U]  (value not drawn)
S20  Cherry  [CHERRY-MX-LED-1.5U]  (value not drawn)
S21  Cherry  [CHERRY-MX-LED-1U]  (value not drawn)
S22  Cherry  [CHERRY-MX-LED-1U]  (value not drawn)
S23  Cherry  [CHERRY-MX-LED-1U]  (value not drawn)
S24  Cherry  [CHERRY-MX-LED-1U]  (value not drawn)
S25  Cherry  [CHERRY-MX-LED-1U]  (value not drawn)
S26  Cherry  [CHERRY-MX-LED-1U]  (value not drawn)
S27  Cherry  [CHERRY-MX-LED-1U]  (value not drawn)
S28  Cherry  [CHERRY-MX-LED-1U]  (value not drawn)
S29  Cherry  [CHERRY-MX-LED-1U]  (value not drawn)
S30  Cherry  [CHERRY-MX-LED-1U]  (value not drawn)
S31  Cherry  [CHERRY-MX-LED-1U]  (value not drawn)
S32  Cherry  [CHERRY-MX-LED-1U]  (value not drawn)
S33  Cherry  [CHERRY-MX-LED-1.5U]  (value not drawn)
S34  Cherry  [CHERRY-MX-LED-1U]  (value not drawn)
S35  Cherry  [CHERRY-MX-LED-1.75U]  (value not drawn)
S36  Cherry  [CHERRY-MX-LED-1U]  (value not drawn)
S37  Cherry  [CHERRY-MX-LED-1U]  (value not drawn)
S38  Cherry  [CHERRY-MX-LED-1U]  (value not drawn)
S39  Cherry  [CHERRY-MX-LED-1U]  (value not drawn)
S40  Cherry  [CHERRY-MX-LED-1U]  (value not drawn)
S41  Cherry  [CHERRY-MX-LED-1U]  (value not drawn)
S42  Cherry  [CHERRY-MX-LED-1U]  (value not drawn)
S43  Cherry  [CHERRY-MX-LED-1U]  (value not drawn)
S44  Cherry  [CHERRY-MX-LED-1U]  (value not drawn)
S45  Cherry  [CHERRY-MX-LED-1U]  (value not drawn)
S46  Cherry  [CHERRY-MX-LED-1U]  (value not drawn)
S47  Cherry  [CHERRY-MX-LED-2.25U]  (value not drawn)
S48  Cherry  [CHERRY-MX-LED-2.25U]  (value not drawn)
S49  Cherry  [CHERRY-MX-LED-1U]  (value not drawn)
S50  Cherry  [CHERRY-MX-LED-1U]  (value not drawn)
S51  Cherry  [CHERRY-MX-LED-1U]  (value not drawn)
S52  Cherry  [CHERRY-MX-LED-1U]  (value not drawn)
S53  Cherry  [CHERRY-MX-LED-1U]  (value not drawn)
S54  Cherry  [CHERRY-MX-LED-1U]  (value not drawn)
S55  Cherry  [CHERRY-MX-LED-1U]  (value not drawn)
S56  Cherry  [CHERRY-MX-LED-1U]  (value not drawn)
S57  Cherry  [CHERRY-MX-LED-1U]  (value not drawn)
S58  Cherry  [CHERRY-MX-LED-1U]  (value not drawn)
S59  Cherry  [CHERRY-MX-LED-1U]  (value not drawn)
S60  Cherry  [CHERRY-MX-LED-1U]  (value not drawn)
S61  Cherry  [CHERRY-MX-LED-1U]  (value not drawn)
S62  Cherry  [CHERRY-MX-LED-1.25U]  (value not drawn)
S63  Cherry  [CHERRY-MX-LED-1.25U]  (value not drawn)
S64  Cherry  [CHERRY-MX-LED-1.5U]  (value not drawn)
S65  Cherry  [CHERRY-MX-LED-2U]  (value not drawn)
S66  Cherry  [CHERRY-MX-LED-1.25U]  (value not drawn)
S67  Cherry  [CHERRY-MX-LED-2.75U]  (value not drawn)
S68  Cherry  [CHERRY-MX-LED-1.5U]  (value not drawn)
S69  Cherry  [CHERRY-MX-LED-1.5U]  (value not drawn)
S70  Cherry  [CHERRY-MX-LED-1.5U]  (value not drawn)

### Nets
CA1: S4.3 S5.3 S6.3 S7.3 S8.3 S9.3 S10.3 S11.3 S19.2 S34.2 ; off-sheet CA1
CA2: S4.2 S19.3 S20.3 S21.3 S22.3 S23.3 S24.3 S25.3 S26.3 S35.2 S48.2 S62.2 ; off-sheet CA2
CA3: S5.2 S20.2 S34.3 S35.3 S36.3 S37.3 S38.3 S39.3 S40.3 S41.3 S49.2 S63.2 ; off-sheet CA3
CA4: S6.2 S21.2 S36.2 S48.3 S49.3 S50.3 S51.3 S52.3 S53.3 S54.3 S64.2 ; off-sheet CA4
CA5: S7.2 S22.2 S37.2 S50.2 S62.3 S63.3 S64.3 S65.3 S66.3 ; off-sheet CA5
CA6: S8.2 S16.2 S23.2 S31.2 S38.2 S46.2 S51.2 S59.2 ; off-sheet CA6, off-sheet CB6  [also labelled CB6]
CA7: S9.2 S17.2 S24.2 S32.2 S39.2 S52.2 S60.2 S65.2 S69.2 ; off-sheet CA7, off-sheet CB7  [also labelled CB7]
CA8: S10.2 S18.2 S25.2 S33.2 S40.2 S47.2 S53.2 S61.2 S66.2 S70.2 ; off-sheet CA8, off-sheet CB8  [also labelled CB8]
CA9: S11.2 S26.2 S41.2 S54.2 ; off-sheet CA9
CB1: S12.3 S13.3 S14.3 S15.3 S16.3 S17.3 S18.3 S27.2 S42.2 S55.2 S67.2 ; off-sheet CB1
CB2: S12.2 S27.3 S28.3 S29.3 S30.3 S31.3 S32.3 S33.3 S43.2 S56.2 ; off-sheet CB2
CB3: S13.2 S28.2 S42.3 S43.3 S44.3 S45.3 S46.3 S47.3 S57.2 S68.2 ; off-sheet CB3
CB4: S14.2 S29.2 S44.2 S55.3 S56.3 S57.3 S58.3 S59.3 S60.3 S61.3 ; off-sheet CB4
CB5: S15.2 S30.2 S45.2 S58.2 S67.3 S68.3 S69.3 S70.3 ; off-sheet CB5
COL0: S4.0 S19.0 S34.0 ; off-sheet COL0  [project net PE3]
COL1: S5.0 S20.0 S35.0 S48.0 S62.0 ; off-sheet COL1  [project net PB0]
COL2: S6.0 S21.0 S36.0 S49.0 S63.0 ; off-sheet COL2  [project net PB1]
COL3: S7.0 S22.0 S37.0 S50.0 S64.0 ; off-sheet COL3  [project net PB2]
COL4: S8.0 S23.0 S38.0 S51.0 ; off-sheet COL4  [project net PB3]
COL5: S9.0 S24.0 S39.0 S52.0 S65.0 ; off-sheet COL5  [project net PB4]
COL6: S10.0 S25.0 S40.0 S53.0 S66.0 ; off-sheet COL6  [project net PB5]
COL7: S11.0 S26.0 S41.0 S54.0 ; off-sheet COL7  [project net PB6]
COL8: S12.0 S27.0 S42.0 S55.0 S67.0 ; off-sheet COL8  [project net PF0]
COL9: S13.0 S28.0 S43.0 S56.0 ; off-sheet COL9  [project net PF1]
COL10: S14.0 S29.0 S44.0 S57.0 S68.0 ; off-sheet COL10  [project net PF2]
COL11: S15.0 S30.0 S45.0 S58.0 ; off-sheet COL11  [project net PF3]
COL12: S16.0 S31.0 S46.0 S59.0 ; off-sheet COL12  [project net PF4]
COL13: S17.0 S32.0 S60.0 S69.0 ; off-sheet COL13  [project net PF5]
COL14: S18.0 S33.0 S47.0 S61.0 S70.0 ; off-sheet COL14  [project net PF6]
ROW0: D0.2 D1.2 D2.2 D3.2 D4.2 D5.2 D6.2 D7.2 D8.2 D9.2 D10.2 D11.2 D12.2 D13.2 D14.2 ; off-sheet ROW0  [project net PD3]
ROW1: D15.2 D16.2 D17.2 D18.2 D19.2 D20.2 D21.2 D22.2 D23.2 D24.2 D25.2 D26.2 D27.2 D28.2 D29.2 ; off-sheet ROW1  [project net PD4]
ROW2: D30.2 D31.2 D32.2 D33.2 D34.2 D35.2 D36.2 D37.2 D38.2 D39.2 D40.2 D41.2 D42.2 D43.2 ; off-sheet ROW2  [project net PD5]
ROW3: D44.2 D45.2 D46.2 D47.2 D48.2 D49.2 D50.2 D51.2 D52.2 D53.2 D54.2 D55.2 D56.2 D57.2 ; off-sheet ROW3  [project net PD6]
ROW4: D58.2 D59.2 D60.2 D61.2 D62.2 D63.2 D64.2 D65.2 D66.2 ; off-sheet ROW4  [project net PD7]
NetD0_1: D0.1 S4.1
NetD1_1: D1.1 S5.1
NetD2_1: D2.1 S6.1
NetD3_1: D3.1 S7.1
NetD4_1: D4.1 S8.1
NetD5_1: D5.1 S9.1
NetD6_1: D6.1 S10.1
NetD7_1: D7.1 S11.1
NetD8_1: D8.1 S12.1
NetD9_1: D9.1 S13.1
NetD10_1: D10.1 S14.1
NetD11_1: D11.1 S15.1
NetD12_1: D12.1 S16.1
NetD13_1: D13.1 S17.1
NetD14_1: D14.1 S18.1
NetD15_1: D15.1 S19.1
NetD16_1: D16.1 S20.1
NetD17_1: D17.1 S21.1
NetD18_1: D18.1 S22.1
NetD19_1: D19.1 S23.1
NetD20_1: D20.1 S24.1
NetD21_1: D21.1 S25.1
NetD22_1: D22.1 S26.1
NetD23_1: D23.1 S27.1
NetD24_1: D24.1 S28.1
NetD25_1: D25.1 S29.1
NetD26_1: D26.1 S30.1
NetD27_1: D27.1 S31.1
NetD28_1: D28.1 S32.1
NetD29_1: D29.1 S33.1
NetD30_1: D30.1 S34.1
NetD31_1: D31.1 S35.1
NetD32_1: D32.1 S36.1
NetD33_1: D33.1 S37.1
NetD34_1: D34.1 S38.1
NetD35_1: D35.1 S39.1
NetD36_1: D36.1 S40.1
NetD37_1: D37.1 S41.1
NetD38_1: D38.1 S42.1
NetD39_1: D39.1 S43.1
NetD40_1: D40.1 S44.1
NetD41_1: D41.1 S45.1
NetD42_1: D42.1 S46.1
NetD43_1: D43.1 S47.1
NetD44_1: D44.1 S48.1
NetD45_1: D45.1 S49.1
NetD46_1: D46.1 S50.1
NetD47_1: D47.1 S51.1
NetD48_1: D48.1 S52.1
NetD49_1: D49.1 S53.1
NetD50_1: D50.1 S54.1
NetD51_1: D51.1 S55.1
NetD52_1: D52.1 S56.1
NetD53_1: D53.1 S57.1
NetD54_1: D54.1 S58.1
NetD55_1: D55.1 S59.1
NetD56_1: D56.1 S60.1
NetD57_1: D57.1 S61.1
NetD58_1: D58.1 S62.1
NetD59_1: D59.1 S63.1
NetD60_1: D60.1 S64.1
NetD61_1: D61.1 S65.1
NetD62_1: D62.1 S66.1
NetD63_1: D63.1 S67.1
NetD64_1: D64.1 S68.1
NetD65_1: D65.1 S69.1
NetD66_1: D66.1 S70.1

### Library data of the parts
D0-D66 = 1N4148W-TP: DIODE GEN PURP 100V 150MA SOD123; Manufacturer: Micro Commercial Co; Capacitance @ Vr, F: 2pF @ 0V, 1MHz; Current - Reverse Leakage @ Vr: 1µA @ 75V; Diode Type: Standard; Reverse Recovery Time (trr): 4ns; Speed: Small Signal =< 200mA (Io), Any Speed; Voltage - Forward (Vf) (Max) @ If: 1.25V @ 150mA; Part Number: 1N4148W-TP; ComponentLink1Description: Datasheet; ComponentLink1URL: https://www.mccsemi.com/pdf/Products/1N4148W(SOD123).pdf; ComponentLink2Description: DigiKey Link; ComponentLink2URL: http://digikey.com/product-detail/en/micro-commercial-co/1N4148W-TP/1N4148WTPMSCT-ND/717311; Current - Average Rectified (Io): 150mA; Device Package: SOD-123; LastUpdated: 1/21/2020 2:42:46 AM; Lifecycle Status: Active; Minimum Order: 1; Mounting Type: Surface Mount; Operating Temperature - Junction: -65°C ~ 150°C; Package / Case: SOD-123; Packaging: TapeAndReel; PartId: 999; Part Status: Active; Price: 0.02; Series: -; Supplier 1: DigiKey; Supplier Part Number 1: 1N4148WTPMSCT-ND; Supplier Device Package: SOD-123; Voltage - DC Reverse (Vr) (Max): 100V
S4-S70 = Cherry_Switch: Cherry SPST Keyswitch

## Nets that join several sheets
GND: Processing_Rev3 (22 pins), BatUSBSwitchRev2 (16 pins)
VCC: Processing_Rev3 (11 pins), BatUSBSwitchRev2 (8 pins)
CA1: Processing_Rev3 (U5.21), KeyMatrixRev2 (10 pins)
CA2: Processing_Rev3 (U5.22), KeyMatrixRev2 (12 pins)
CA3: Processing_Rev3 (U5.23), KeyMatrixRev2 (12 pins)
CA4: Processing_Rev3 (U5.24), KeyMatrixRev2 (11 pins)
CA5: Processing_Rev3 (U5.25), KeyMatrixRev2 (9 pins)
CA6: Processing_Rev3 (U5.12 U5.26), KeyMatrixRev2 (8 pins)
CA7: Processing_Rev3 (U5.13 U5.27), KeyMatrixRev2 (9 pins)
CA8: Processing_Rev3 (U5.14 U5.28), KeyMatrixRev2 (10 pins)
CA9: Processing_Rev3 (U5.1), KeyMatrixRev2 (S11.2 S26.2 S41.2 S54.2)
CB1: Processing_Rev3 (U5.7), KeyMatrixRev2 (11 pins)
CB2: Processing_Rev3 (U5.8), KeyMatrixRev2 (10 pins)
CB3: Processing_Rev3 (U5.9), KeyMatrixRev2 (10 pins)
CB4: Processing_Rev3 (U5.10), KeyMatrixRev2 (10 pins)
CB5: Processing_Rev3 (U5.11), KeyMatrixRev2 (8 pins)
LED_EN: Processing_Rev3 (R16.2 U5.3), BatUSBSwitchRev2 (Q1.3 R9.1)
PB0: Processing_Rev3 (U0.10), KeyMatrixRev2 (5 pins)
PB1: Processing_Rev3 (U0.11), KeyMatrixRev2 (5 pins)
PB2: Processing_Rev3 (U0.12), KeyMatrixRev2 (5 pins)
PB3: Processing_Rev3 (U0.13), KeyMatrixRev2 (S8.0 S23.0 S38.0 S51.0)
PB4: Processing_Rev3 (U0.14), KeyMatrixRev2 (5 pins)
PB5: Processing_Rev3 (U0.15), KeyMatrixRev2 (5 pins)
PB6: Processing_Rev3 (U0.16), KeyMatrixRev2 (S11.0 S26.0 S41.0 S54.0)
PD3: Processing_Rev3 (U0.28), KeyMatrixRev2 (15 pins)
PD4: Processing_Rev3 (U0.29), KeyMatrixRev2 (15 pins)
PD5: Processing_Rev3 (U0.30), KeyMatrixRev2 (14 pins)
PD6: Processing_Rev3 (U0.31), KeyMatrixRev2 (14 pins)
PD7: Processing_Rev3 (U0.32), KeyMatrixRev2 (9 pins)
PE3: Processing_Rev3 (U0.9), KeyMatrixRev2 (S4.0 S19.0 S34.0)
PF0: Processing_Rev3 (U0.61), KeyMatrixRev2 (5 pins)
PF1: Processing_Rev3 (U0.60), KeyMatrixRev2 (S13.0 S28.0 S43.0 S56.0)
PF2: Processing_Rev3 (U0.59), KeyMatrixRev2 (5 pins)
PF3: Processing_Rev3 (U0.58), KeyMatrixRev2 (S15.0 S30.0 S45.0 S58.0)
PF4: Processing_Rev3 (U0.57), KeyMatrixRev2 (S16.0 S31.0 S46.0 S59.0)
PF5: Processing_Rev3 (U0.56), KeyMatrixRev2 (S17.0 S32.0 S60.0 S69.0)
PF6: Processing_Rev3 (U0.55), KeyMatrixRev2 (5 pins)
VUSB: Processing_Rev3 (J0.1 J0.10 U0.8), BatUSBSwitchRev2 (R8.2 S2.1 U3.3)